# EAGLE design watter.flow.metter (EAGLE 8.2.2)
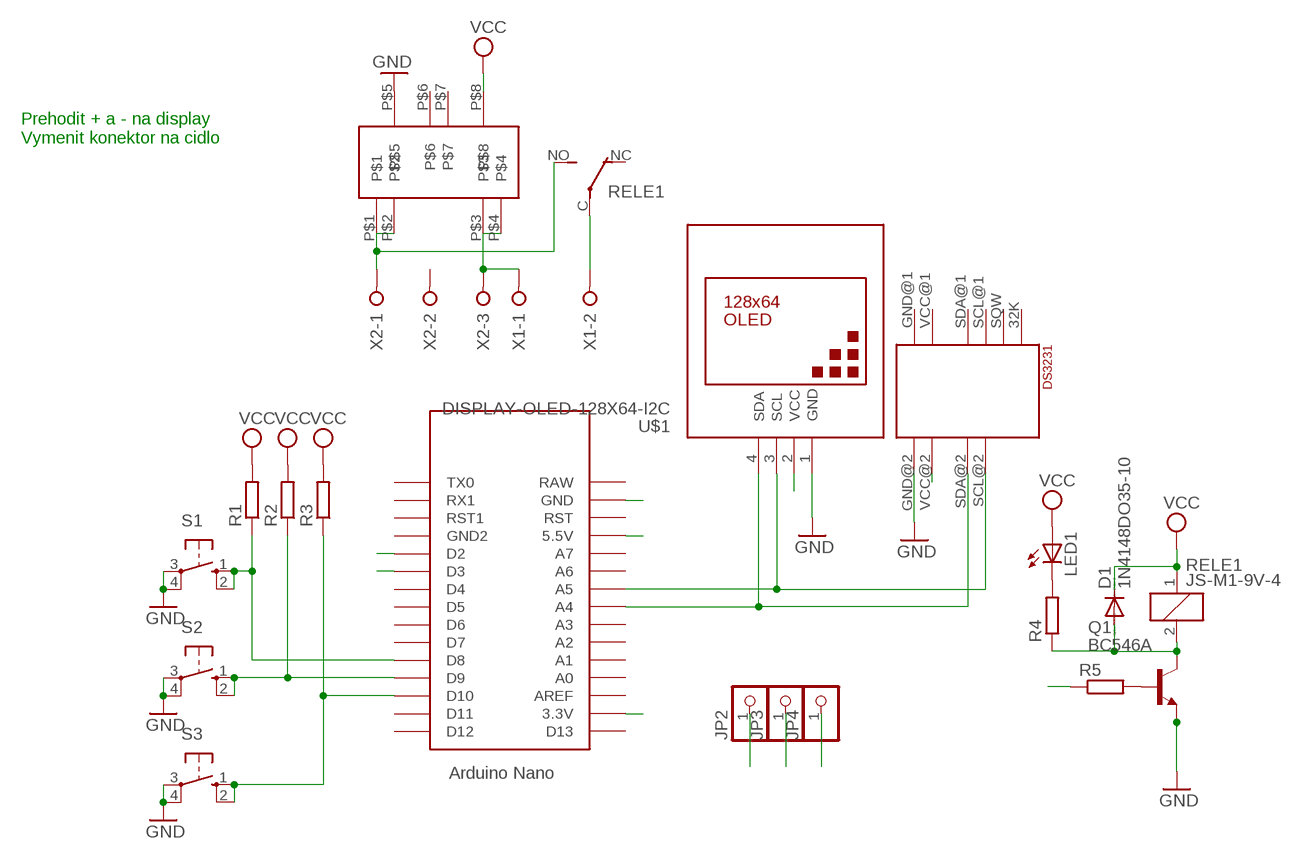
[diagram p0: schematic, sheet 1]

## Parts
D1  1N4148DO35-10  [DO35-10]
JP2  PINHD-1X1  [1X01]
JP3  PINHD-1X1  [1X01]
JP4  PINHD-1X1  [1X01]
LED1  LED3MM  [LED3MM]
Q1  BC546A  [TO92-EBC]
R1  R-EU_0207/10  [0207/10]
R2  R-EU_0207/10  [0207/10]
R3  R-EU_0207/10  [0207/10]
R4  R-EU_0207/10  [0207/10]
R5  R-EU_0207/15  [0207/15]
RELE1  JS-M1-9V-4  [JS-M]
S1  10-XX  [B3F-10XX]
S2  10-XX  [B3F-10XX]
S3  10-XX  [B3F-10XX]
U$1  DISPLAY-OLED-128X64-I2C  [DISPLAY-OLED-128X64-I2C]
U$2  PWR5V  [SUPP]
U$5  NANO  [NANO]
U$6  DS3231BOARD  [BOARD]
X1  W237-02P  [W237-132]
X2  W237-3E  [W237-3E]

## Nets
3.3V: U$1.2(VCC) U$5.3.3V U$6.VCC@2(VCC)
D2: JP3.1 U$5.D2
D3: R5.1 U$5.D3
GND: JP4.1 Q1.E S1.3(P) S1.4(P1) S2.3(P) S2.4(P1) S3.3(P) S3.4(P1) U$1.1(GND) U$2.P$5 U$5.GND U$6.GND@2(GND)
N$1: RELE1.C(2:P) X1.2
N$2: R1.1 S1.1(S) S1.2(S1) U$5.D8
N$3: U$2.P$3 U$2.P$4 X1.1 X2.3
N$4: RELE1.NO(2:S) U$2.P$1 U$2.P$2 X2.1
N$5: R2.1 S2.1(S) S2.2(S1) U$5.D9
N$6: R3.1 S3.1(S) S3.2(S1) U$5.D10
N$7: Q1.B R5.2
N$8: LED1.K(C) R4.2
N$41: D1.A Q1.C R4.1 RELE1.2
SCL: U$1.3(SCL) U$5.A5 U$6.SCL@2(SCL)
SDA: U$1.4(SDA) U$5.A4 U$6.SDA@2(SDA)
VCC: D1.C JP2.1 LED1.A R1.2 R2.2 R3.2 RELE1.1 U$2.P$8 U$5.5V(5.5V)
Unconnected: RELE1.NC(2:O) U$2.P$6 U$2.P$7 U$5.A0 U$5.A1 U$5.A2 U$5.A3 U$5.A6 U$5.A7 U$5.AREF U$5.D4 U$5.D5 U$5.D6 U$5.D7 U$5.D11 U$5.D12 U$5.D13 U$5.GND1(GND2) U$5.RAW U$5.RST U$5.RST1 U$5.RX1 U$5.TX0 U$6.32K U$6.SCL@1(SCL) U$6.SDA@1(SDA) U$6.SQW X2.2

## Notes on the sheet
- Prehodit + a - na display
  Vymenit konektor na cidlo

## Power pins joined to a net without a drawn wire
GND: U$6.GND@1(GND)
VCC: U$6.VCC@1(VCC)

## Library data of the parts
D1 = diode:1N4148: DIODE high speed (Philips)
JP2-JP4 = pinhead:PINHD-1X1: PIN HEADER
LED1 = led:LED: LED OSRAM: - CHIPLED LG R971, LG N971, LY N971, LG Q971, LY Q971, LO R971, LY R971 LH N974, LH R974 LS Q976, LO Q976, LY Q976 LO Q996 - Hyper CHIPLED LW Q18S LB Q993, LB Q99A, LB R99A - SideLED LS A670, LO A670, LY A670, LG A670, LP A670 LB A673, LV A673, LT A673, LW A673 LH A674 LY A675 LS A676, LA A676, LO A676, LY A676, LW A676 LS A679, LY A679, LG A679 - Hyper Micro SIDELED® LS Y876, LA Y876, LO Y876, LY Y876 LT Y87S - SmartLED LW L88C, LW L88S LB L89C, LB L89S, LG L890 LS L89K, LO L89K, LY L89K LS L896, LA L896, LO L896, LY L896 - TOPLED LS T670, LO T670, LY T670, LG T670, LP T670 LSG T670, LSP T670, LSY T670, LOP T670, LYG T670 LG T671, LOG T671, LSG T671 LB T673, LV T673, LT T673, LW T673 LH T674 LS T676, LA T676, LO T676, LY T676, LB T676, LH T676, LSB T676, LW T676 LB T67C, LV T67C, LT T67C, LS T67K, LO T67K, LY T67K, LW E67C LS E67B, LA E67B, LO E67B, LY E67B, LB E67C, LV E67C, LT E67C LW T67C LS T679, LY T679, LG T679 LS T770, LO T770, LY T770, LG T770, LP T770 LB T773, LV T773, LT T773, LW T773 LH T774 LS E675, LA E675, LY E675, LS T675 LS T776, LA T776, LO T776, LY T776, LB T776 LHGB T686 LT T68C, LB T68C - Hyper Mini TOPLED® LB M676 - Mini TOPLED Santana® LG M470 LS M47K, LO M47K, LY M47K Source: http://www.osram.convergy.de LUXEON: - LUMILED® LXK2-PW12-R00, LXK2-PW12-S00, LXK2-PW14-U00, LXK2-PW14-V00 LXK2-PM12-R00, LXK2-PM12-S00, LXK2-PM14-U00 LXK2-PE12-Q00, LXK2-PE12-R00, LXK2-PE12-S00, LXK2-PE14-T00, LXK2-PE14-U00 LXK2-PB12-K00, LXK2-PB12-L00, LXK2-PB12-M00, LXK2-PB14-N00, LXK2-PB14-P00, LXK2-PB14-Q00 LXK2-PR12-L00, LXK2-PR12-M00, LXK2-PR14-Q00, LXK2-PR14-R00 LXK2-PD12-Q00, LXK2-PD12-R00, LXK2-PD12-S00 LXK2-PH12-R00, LXK2-PH12-S00 LXK2-PL12-P00, LXK2-PL12-Q00, LXK2-PL12-R00 Source: www.luxeon.com KINGBRIGHT: KA-3528ASYC Source: www.kingbright.com
Q1 = transistor-npn:BC546*: NPN Transistor
R1-R5 = rcl:R-EU_: RESISTOR, European symbol
RELE1 = relay:JS-M1*: Automotive Ultra-Miniature Power Relay NAiS Source: http://www.mew-europe.com/.. en_ds_61211_0000.pdf; OC_FARNELL: unknown; OC_NEWARK: unknown
S1-S3 = switch-omron:10-XX: OMRON SWITCH; MPN: B3F-1000; OC_FARNELL: 176432; OC_NEWARK: 36M3542
U$1 = diy-modules:DISPLAY-OLED-128X64-I2C: 128x64 Dot Matrix OLED Module based on SSD1306 chip Variant with I2C interface More details available here: http://www.instructables.com/id/Monochrome-096-i2c-OLED-display-with-arduino-SSD13/ SSD1306 datasheet: https://cdn-shop.adafruit.com/datasheets/SSD1306.pdf Click here to find device on ebay.com <http://www.ebay.com/sch/oled+display+128x64+iic> Note: There are two variants: I2C and SPI. Search for the proper version.
U$2 = SOURCE:PWR5V
U$5 = Arduino:NANO: Arduino Nano
U$6 = DS3232M:DS3231BOARD
X1 = con-wago-508:W237-02P: WAGO SREW CLAMP; OC_FARNELL: unknown; OC_NEWARK: unknown
X2 = con-wago-508:W237-3E: WAGO SREW CLAMP; OC_FARNELL: unknown; OC_NEWARK: unknown

## Net classes
0 default: width 0.406 mm, drill 0.406 mm, clearance 0.406 mm
3 power usb: width 0.508 mm, drill 0.406 mm, clearance 0.203 mm

## Board
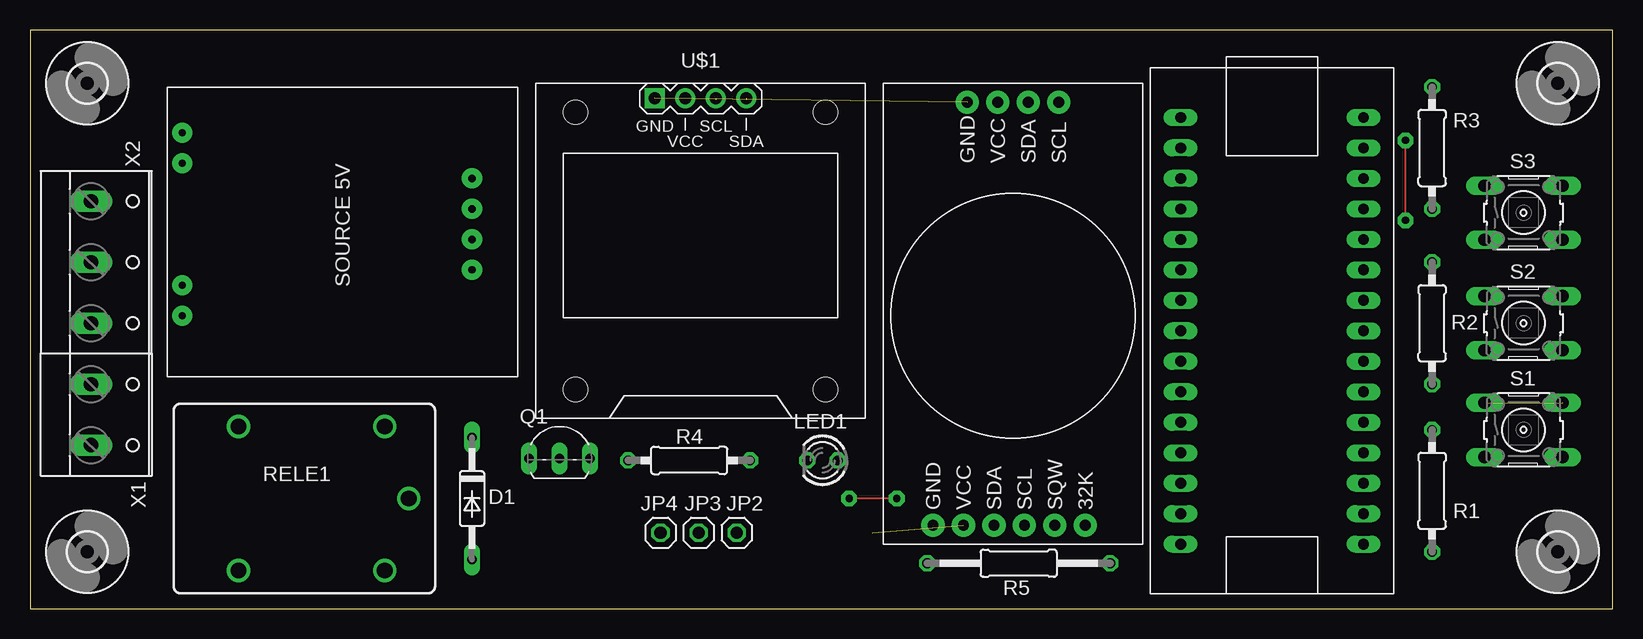
[diagram p1: board, top side]
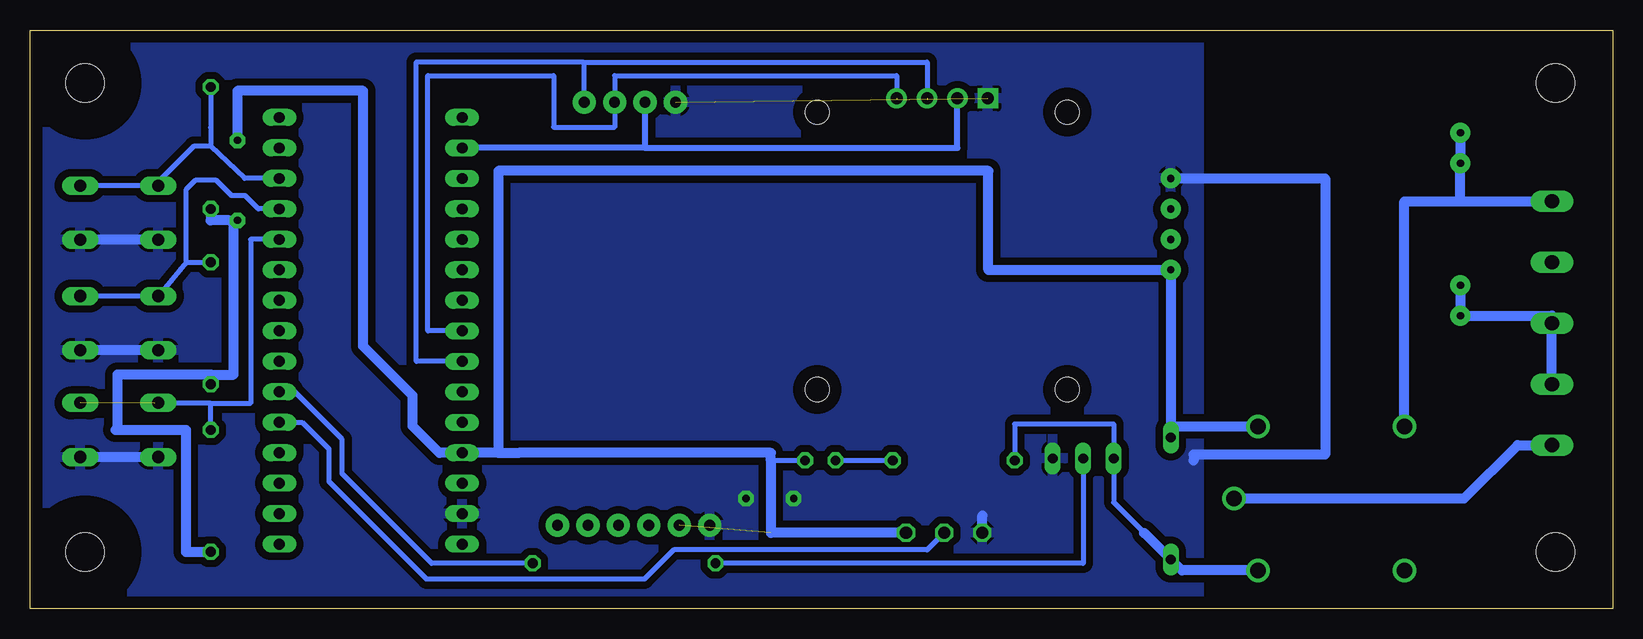
[diagram p2: board, bottom side, seen from below]

Size 131.9 x 48.25 mm. Coordinates in mm from the lower left corner, seen from the top.
Outline: 0,0 131.9,0 131.9,48.25 0,48.25 0,0
Copper layers (1*16): Top 0.035mm / dielectric 1.5mm / Bottom 0.035mm
Design rules "default": minimum track width 6mil, minimum drill 0.35mm, track to track 6mil, track to pad 6mil, pad to pad 6mil, via to via 6mil, smd to smd 6mil, copper to edge 40mil, drill to drill 6mil, minimum pad ring 10mil, minimum via ring 8mil, stop-mask expansion 4mil, vias tented up to drill 0mil, thermal gap 10mil

### Footprints (pad centres in the part's own frame; a part is rotated, then mirrored left to right if it is on the bottom)
DO35-10 = drill 0.813 long: A 5.08,0; C -5.08,0
1X01 = drill 1.016 octagon: 1 0,0
LED3MM = drill 0.813 octagon: A -1.27,0; K 1.27,0
TO92-EBC = drill 0.813 long: B 0,-1.27; C -2.54,-1.27; E 2.54,-1.27
0207/10 = drill 0.813 octagon: 1 -5.08,0; 2 5.08,0
0207/15 = drill 0.813 octagon: 1 -7.62,0; 2 7.62,0
JS-M = drill 1.3: 1 6.7,6; 2 6.7,-6; C 8.7,0; NC -5.5,-6; NO -5.5,6
B3F-10XX = drill 1.016 long: 1 -3.251,2.261; 2 3.251,2.261; 3 -3.251,-2.261; 4 3.251,-2.261
DISPLAY-OLED-128X64-I2C = drill 1 pad 1.676 square: 1 -3.81,12.7 | drill 1 pad 1.676: 2 -1.27,12.7; 3 1.27,12.7; 4 3.81,12.7 | hole 2: -10.414,11.557; 10.414,11.557; 10.414,-11.557; -10.414,-11.557
SUPP = drill 0.6 pad 1.676: P$1 -12.7,-10.16; P$2 -10.16,-10.16; P$3 0,-10.16; P$4 2.54,-10.16; P$5 -8.89,13.97; P$6 -6.35,13.97; P$7 -3.81,13.97; P$8 -1.27,13.97
3,2 = hole 3.2: 0,0
NANO = drill 0.9 long: 3.3V -10.16,24.13; 5V -10.16,-1.27; A0 -10.16,19.05; A1 -10.16,16.51; A2 -10.16,13.97; A3 -10.16,11.43; A4 -10.16,8.89; A5 -10.16,6.35; A6 -10.16,3.81; A7 -10.16,1.27; AREF -10.16,21.59; D2 5.08,1.27; D3 5.08,3.81; D4 5.08,6.35; D5 5.08,8.89; D6 5.08,11.43; D7 5.08,13.97; D8 5.08,16.51; D9 5.08,19.05; D10 5.08,21.59; D11 5.08,24.13; D12 5.08,26.67; D13 -10.16,26.67; GND -10.16,-6.35; GND1 5.08,-1.27; RAW -10.16,-8.89; RST -10.16,-3.81; RST1 5.08,-3.81; RX1 5.08,-6.35; TX0 5.08,-8.89
BOARD = drill 0.9 pad 1.93: 32K 16.828,-36.83; GND@1 4.128,-36.83; GND@2 6.985,-1.587; SCL@1 11.748,-36.83; SCL@2 14.605,-1.587; SDA@1 9.207,-36.83; SDA@2 12.065,-1.587; SQW 14.287,-36.83; VCC@1 6.668,-36.83; VCC@2 9.525,-1.587
W237-132 = drill 1.194 long: 1 -2.54,-0.635; 2 2.54,-0.635
W237-3E = drill 1.194 long: 1 -5.08,-0.635; 2 0,-0.635; 3 5.08,-0.635

### Placement (x,y rotation side)
D1  36.83,9.21 270 top
JP2  58.9,6.35 0 top
JP3  55.72,6.35 0 top
JP4  52.55,6.35 0 top
LED1  66.04,12.38 180 top
Q1  44.13,13.81 0 top
R1  116.84,9.84 270 top
R2  116.84,23.81 270 top
R3  116.84,38.42 270 top
R4  54.93,12.38 0 top
R5  82.39,3.81 180 top
RELE1  22.86,9.21 0 top
S1  124.46,14.92 0 top
S2  124.46,23.81 0 top
S3  124.46,33.02 0 top
U$1  55.88,29.84 0 top
U$2  22.86,26.99 270 top
U$3  [3,2]  4.76,43.81 0 top
U$4  [3,2]  4.76,4.76 0 top
U$5  106.05,14.29 0 top
U$6  71.12,43.81 0 top
U$7  [3,2]  127.32,43.81 0 top
U$8  [3,2]  127.32,4.76 0 top
X1  5.71,16.19 270 top
X2  5.71,28.89 270 top

### Tracks (layer width: path | path; a pad name or v marks a point on that pad's centre or on a via)
3.3V
  Bottom 0.508: 80.64,38.42 U$6.VCC@2 | 80.64,38.42 U$5.3.3V | 80.64,38.42 54.61,38.42 U$1.2
D2
  Bottom 0.406: JP3.1 57.15,4.92 78.26,4.92 80.7,2.49 98.85,2.49 107,10.64 107,13.34 109.22,15.56 U$5.D2
D3
  Bottom 0.406: R5.1 98.42,3.81 105.89,11.27 105.89,14.13 109.86,18.1 U$5.D3
GND  (via drill 0.6 pad 1.3)  (1 unrouted)
  Top 0.127: v72.23,9.21 v68.26,9.21
  Bottom 0.813: S3.3 S3.4 | S2.3 S2.4 | S1.3 S1.4 | JP4.1 52.55,7.78 | U$2.P$5 23.97,35.88 23.97,12.86 34.92,12.86 34.92,12.38
  pour Bottom (isolate 0.61): 34.45,48.1 132.08,48.1 132.08,0 34.45,0
N$1
  Bottom 0.813: RELE1.C 12.38,9.21 7.94,13.65 X1.2
N$2  (1 unrouted)
  Bottom 0.406: U$5.D8 113.51,30.8 113.51,17.14 116.88,17.14 | 116.88,17.14 121.49,17.14 S1.1 | R1.1 116.84,17.11 116.88,17.14
N$3
  Bottom 0.813: X1.1 X2.3 5.08,24.45 U$2.P$4 U$2.P$3
N$4
  Bottom 0.813: U$2.P$1 U$2.P$2 12.7,33.97 | 12.7,33.97 X2.1 | 12.7,33.97 17.36,33.97 RELE1.NO
N$5
  Bottom 0.406: S2.1 S2.2 | S2.1 121.64,26.07 | 118.87,28.89 118.9,28.89 118.9,34.92 118.11,35.72 116.36,35.72 115.09,34.45 113.98,34.45 112.87,33.34 U$5.D9 | 118.87,28.89 R2.1 | 118.87,28.89 S2.1
N$6
  Bottom 0.406: 121.53,35.28 S3.1 | 121.53,35.28 S3.2 | R3.1 116.84,40.13 116.83,38.55 | U$5.D10 114.01,35.88 116.83,38.55 | 116.83,38.55 118.27,38.55 121.53,35.28
N$7
  Bottom 0.406: Q1.B 44.13,3.81 R5.2
N$8
  Bottom 0.406: LED1.K R4.2
N$41
  Bottom 0.406: R4.1 49.85,15.4 41.59,15.4 Q1.C 41.59,8.89 39.05,6.35
  Bottom 0.813: RELE1.2 35.91,3.21 D1.A 39.05,6.35
SCL  (1 unrouted)
  Bottom 0.406: 85.81,45.56 99.69,45.56 99.69,20.64 U$5.A5 | 85.81,45.56 57.15,45.56 57.15,42.43 | 85.72,42.35 U$6.SCL@2 85.72,45.48 85.81,45.56
SDA  (1 unrouted)
  Bottom 0.406: U$5.A4 98.74,23.18 98.74,44.45 88.27,44.45 88.27,40.16 83.19,40.16 U$6.SDA@2 83.19,44.45 59.69,44.45 59.69,42.43
VCC  (via drill 0.6 pad 1.3)  (1 unrouted)
  Top 0.127: v114.62,32.38 v114.62,39.05
  Bottom 0.406: LED1.A 70.17,12.37
  Bottom 0.813: v114.62,39.05 114.62,43.18 104.14,43.18 104.14,21.91 100.01,17.78 100.01,15.24 97.79,13.02 U$5.5V 92.87,13.02 | 91.18,13.02 92.48,13.02 92.87,13.02 | 116.8,19.53 114.94,19.53 114.94,32.2 115.28,32.38 | 116.8,19.53 124.62,19.53 124.62,15.08 124.78,14.92 118.9,14.92 118.9,4.76 R1.2 | R2.2 116.84,19.49 116.8,19.53 | R3.2 116.84,32.38 115.28,32.38 | 91.18,13.02 | 91.18,13.02 70.17,13.02 70.17,12.37 70.17,6.35 JP2.1 | LED1.A | 115.28,32.38 v114.62,32.38 | RELE1.1 36.83,15.21 D1.C U$2.P$8 52.03,28.26 52.03,36.51 92.87,36.51 92.87,13.02